# Altium schematic sheet IO Expansioin.SchDoc
size A
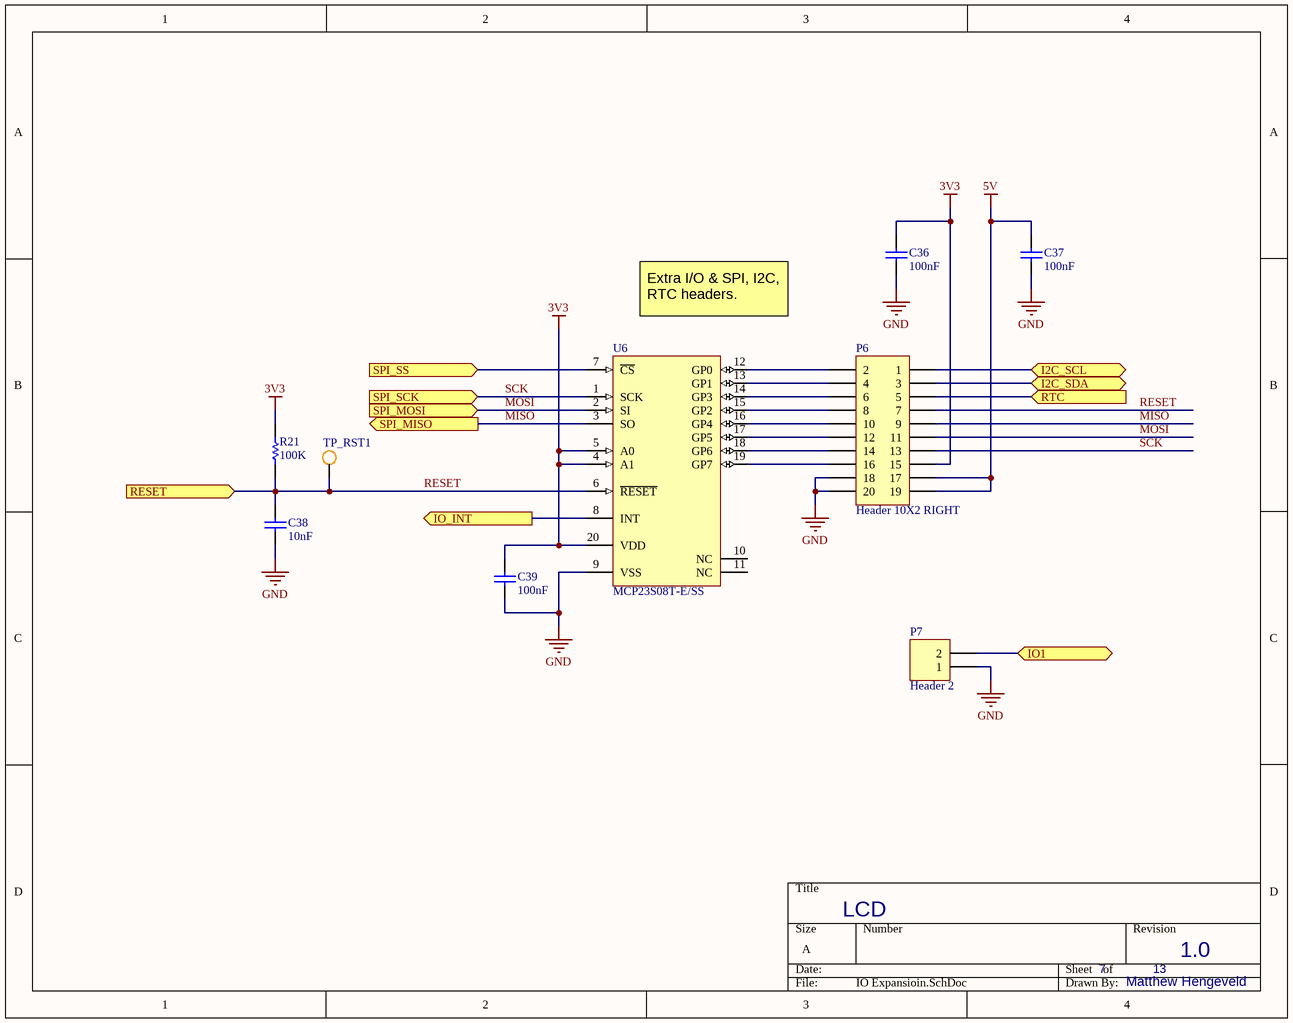
[diagram p0: IO Expansioin.SchDoc]

## Parts
C36  100nF  [CAPC1608X92X38LL15T08]
C37  100nF  [CAPC1608X92X38LL15T08]
C38  10nF  [CAPC1608X92X38LL15T08]
C39  100nF  [CAPC1608X92X38LL15T08]
P6  Header 10X2 RIGHT  [HDR2X10 RIGHT]
P7  Header 2  [HDR1X2]
R21  100K  [RESC1608X55X30LL15T15]
TP_RST1  Test point  [SMD Test Hook]  (value not drawn)
U6  MCP23S08T-E/SS  [SSOP-20]

## Ports
I2C_SCL (bidir), I2C_SDA (bidir), IO1 (bidir), IO_INT (out), RESET (in), RTC (in), SPI_MISO (out), SPI_MOSI (in), SPI_SCK (in), SPI_SS (in)

## Nets
3V3: C36.2 C39.2 P6.15 R21.1 U6.4(A1) U6.5(A0) U6.20(VDD)
5V: C37.2 P6.17 P6.19
GND: C36.1 C37.1 C38.1 C39.1 P6.18 P6.20 P7.1 U6.9(VSS)
I2C_SCL: P6.1 ; port I2C_SCL
I2C_SDA: P6.3 ; port I2C_SDA
IO1: P7.2 ; port IO1
IO_INT: U6.8(INT) ; port IO_INT
MISO: P6.9 U6.3(SO) ; port SPI_MISO
MOSI: P6.11 U6.2(SI) ; port SPI_MOSI
RESET: C38.2 P6.7 R21.2 TP_RST1.1(point) U6.6(~{RESET}) ; port RESET
RTC: P6.5 ; port RTC
SCK: P6.13 U6.1(SCK) ; port SPI_SCK
SPI_SS: U6.7(~{CS}) ; port SPI_SS
NetP6_2: P6.2 U6.12(GP0)
NetP6_4: P6.4 U6.13(GP1)
NetP6_6: P6.6 U6.14(GP3)
NetP6_8: P6.8 U6.15(GP2)
NetP6_10: P6.10 U6.16(GP4)
NetP6_12: P6.12 U6.17(GP5)
NetP6_14: P6.14 U6.18(GP6)
NetP6_16: P6.16 U6.19(GP7)

Not connected (* = marked no-connect by the designer): U6 10(NC) 11(NC)

## Notes on the sheet
- Extra I/O & SPI, I2C, RTC headers.
- LCD
- 7
- 13
- 1.0
- Matthew Hengeveld

## Library data of the parts
C36-C39 = CMP-2006-01974-1: Part Number: VJ0603Y104KNXAO; Manufacturer: Vitramon
P6 = Header 10X2 RIGHT: Header, 10-Pin, Dual row, Right Angle; LatestRevisionDate: 17-Jul-2002; LatestRevisionNote: Re-released for DXP Platform.; Publisher: Altium Limited
P7 = Header 2: Header, 2-Pin; LatestRevisionDate: 17-Jul-2002; LatestRevisionNote: Re-released for DXP Platform.; Publisher: Altium Limited
R21 = CMP-2000-00704-1: Manufacturer: Panasonic; Part Number: ERJ-3GEYJ103V
U6 = CMP-0186-00165-3: 8-Bit I/O Expander with Serial Interface, 20-Pin SSOP, Extended Temperature, Tape and Reel; PackageReference: SSOP-SS20; ComponentLink3URL: http://www.microchip.com/stellent/groups/techpub_sg/documents/packagingspec/en012702.pdf; ComponentLink1URL: http://www.microchip.com/; ComponentLink1Description: Manufacturer URL; DatasheetVersion: revE, Aug-2007; Code_JEDEC: MO-150; ComponentLink3Description: Package Specification; PackageVersion: revBB, Aug-2009; PackageDescription: 20-Lead Plastic Shrink Small Outline (SS) - 5.3mm Body [SSOP]; RevisionNote: Sch corrected.; ComponentLink2Description: Datasheet; ComponentLink2URL: http://ww1.microchip.com/downloads/en/DeviceDoc/21919e.pdf